# Altium schematic sheet Balance_CAR.SchDoc
size A4
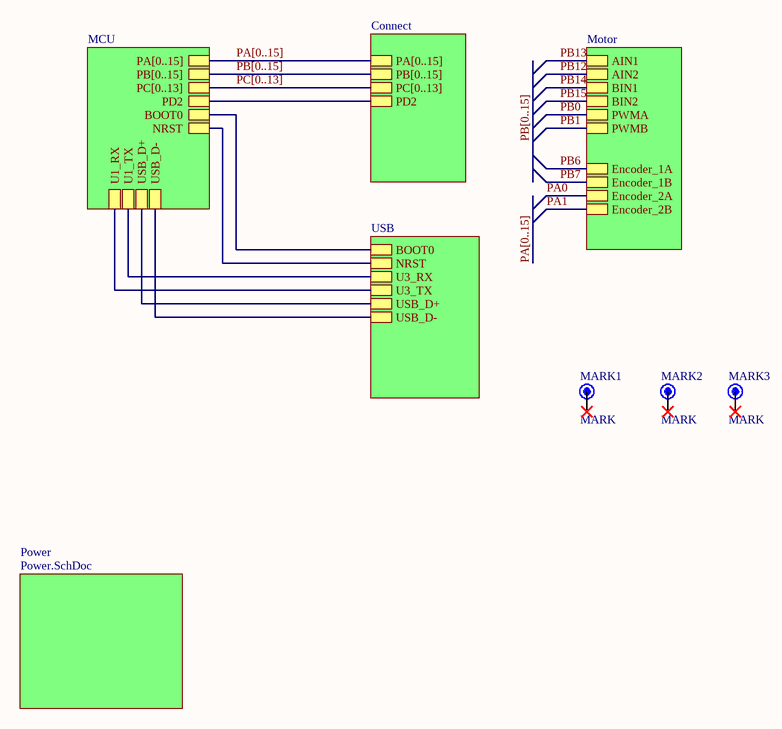
[diagram p0: Balance_CAR.SchDoc]

## Parts
MARK1  MARK  [MARK_GLOBAL]
MARK2  MARK  [MARK_GLOBAL]
MARK3  MARK  [MARK_GLOBAL]

## Sub-sheets
Connect = Connect.SchDoc: PA[0..15], PB[0..15], PC[0..13], PD2
MCU = MCU.SchDoc: BOOT0, NRST, PA[0..15], PB[0..15], PC[0..13], PD2, U1_RX, U1_TX, USB_D+, USB_D-
Motor = Motor_TB6612.SchDoc: AIN1, AIN2, BIN1, BIN2, PWMA, PWMB, Encoder_1A, Encoder_1B, Encoder_2A, Encoder_2B
Power = Power.SchDoc: no entries
USB = CH340.SchDoc: BOOT0, NRST, U3_RX, U3_TX, USB_D+, USB_D-

## Nets
PA0: sheet Motor/Encoder_2A
PA1: sheet Motor/Encoder_2B
PB0: sheet Motor/PWMA
PB1: sheet Motor/PWMB
PB6: sheet Motor/Encoder_1A
PB7: sheet Motor/Encoder_1B
PB12: sheet Motor/AIN2
PB13: sheet Motor/AIN1
PB14: sheet Motor/BIN1
PB15: sheet Motor/BIN2
(unnamed): sheet MCU/BOOT0, sheet USB/BOOT0
(unnamed): sheet MCU/NRST, sheet USB/NRST
(unnamed): sheet MCU/PD2, sheet Connect/PD2
(unnamed): sheet MCU/U1_RX, sheet USB/U3_TX
(unnamed): sheet MCU/U1_TX, sheet USB/U3_RX
(unnamed): sheet MCU/USB_D+, sheet USB/USB_D+
(unnamed): sheet MCU/USB_D-, sheet USB/USB_D-

Not connected (* = marked no-connect by the designer): MARK1 1*; MARK2 1*; MARK3 1*

## Buses and harness runs
bus PA[0..15]
bus PA[0..15] = sheet Connect/PA[0..15] = sheet MCU/PA[0..15]
bus PB[0..15]
bus PB[0..15] = sheet Connect/PB[0..15] = sheet MCU/PB[0..15]
bus PC[0..13] = sheet Connect/PC[0..13] = sheet MCU/PC[0..13]

## Library data of the parts
MARK1-MARK3 = MARK: 光学定位点